# Altium schematic sheet PCB_LED_CALENDAR__SINGLE_YEAR_DIGIT.SchDoc
size A4; Author: Andrzej Laczewski; DrawnBy: Andrzej Laczewski; SheetNumber: 3; SheetTotal: 4
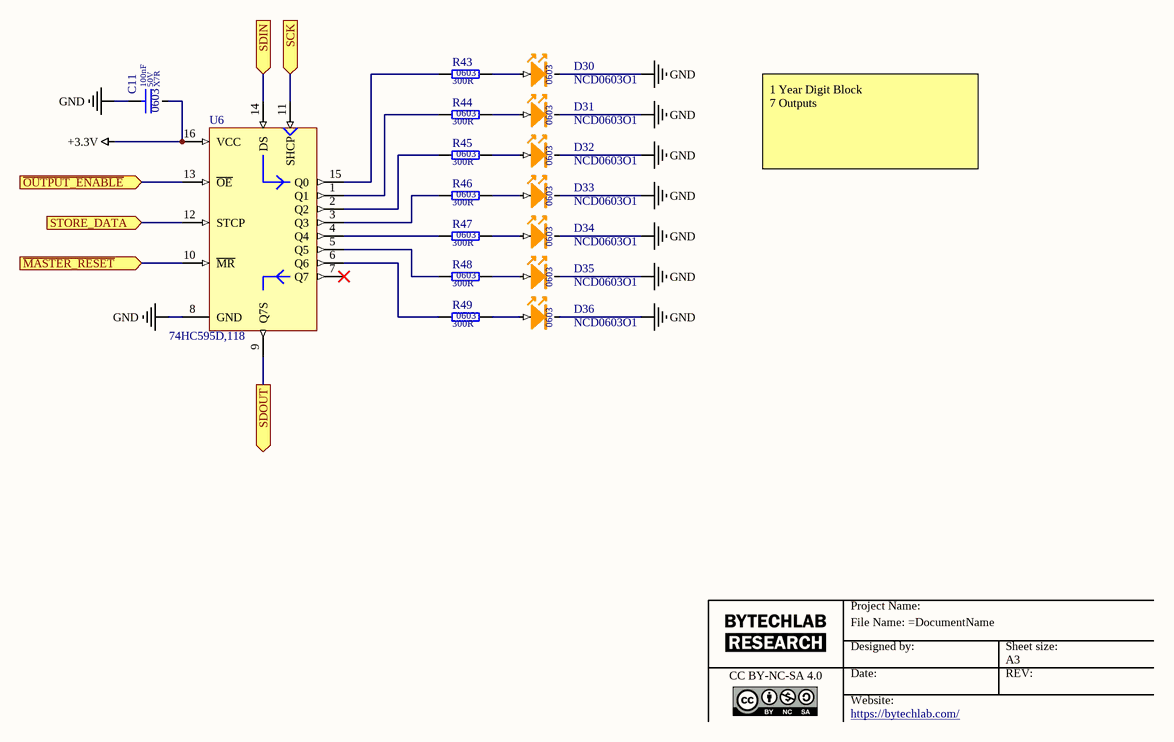
[diagram p0: PCB_LED_CALENDAR__SINGLE_YEAR_DIGIT.SchDoc]

## Parts
C11  value 100nF  Dielectric: X7R  Voltage: 50V  SCH_Footprint: 0603  [C_0603_1608]  (hidden comment: Ceramic X7R)
D30  NCD0603O1  SCH_Footprint: 0603  [LED_0603]
D31  NCD0603O1  SCH_Footprint: 0603  [LED_0603]
D32  NCD0603O1  SCH_Footprint: 0603  [LED_0603]
D33  NCD0603O1  SCH_Footprint: 0603  [LED_0603]
D34  NCD0603O1  SCH_Footprint: 0603  [LED_0603]
D35  NCD0603O1  SCH_Footprint: 0603  [LED_0603]
D36  NCD0603O1  SCH_Footprint: 0603  [LED_0603]
R43  value 300R  SCH_Footprint: 0603  [R_0603_1608]  (hidden comment: Resistor)
R44  value 300R  SCH_Footprint: 0603  [R_0603_1608]  (hidden comment: Resistor)
R45  value 300R  SCH_Footprint: 0603  [R_0603_1608]  (hidden comment: Resistor)
R46  value 300R  SCH_Footprint: 0603  [R_0603_1608]  (hidden comment: Resistor)
R47  value 300R  SCH_Footprint: 0603  [R_0603_1608]  (hidden comment: Resistor)
R48  value 300R  SCH_Footprint: 0603  [R_0603_1608]  (hidden comment: Resistor)
R49  value 300R  SCH_Footprint: 0603  [R_0603_1608]  (hidden comment: Resistor)
U6  74HC595D,118  [SO16]

## Ports
SCK (in), SDIN (in), SDOUT (out), STORE_DATA (in), ~{MASTER_RESET} (in), ~{OUTPUT_ENABLE} (in)

## Nets
+3.3V: C11.2 U6.16(VCC)
GND: C11.1 D30.1(K) D31.1(K) D32.1(K) D33.1(K) D34.1(K) D35.1(K) D36.1(K) U6.8(GND)
~{MASTER_RESET}: U6.10(~{MR}) ; port ~{MASTER_RESET}
~{OUTPUT_ENABLE}: U6.13(~{OE}) ; port ~{OUTPUT_ENABLE}
SCK: U6.11(SHCP) ; port SCK
SDIN: U6.14(DS) ; port SDIN
SDOUT: U6.9(Q7S) ; port SDOUT
STORE_DATA: U6.12(STCP) ; port STORE_DATA
NetD30_2: D30.2(A) R43.2
NetD31_2: D31.2(A) R44.2
NetD32_2: D32.2(A) R45.2
NetD33_2: D33.2(A) R46.2
NetD34_2: D34.2(A) R47.2
NetD35_2: D35.2(A) R48.2
NetD36_2: D36.2(A) R49.2
NetR43_1: R43.1 U6.15(Q0)
NetR44_1: R44.1 U6.1(Q1)
NetR45_1: R45.1 U6.2(Q2)
NetR46_1: R46.1 U6.3(Q3)
NetR47_1: R47.1 U6.4(Q4)
NetR48_1: R48.1 U6.5(Q5)
NetR49_1: R49.1 U6.6(Q6)

Not connected (* = marked no-connect by the designer): U6 7(Q7)*

## Notes on the sheet
- 1 Year Digit Block
  7 Outputs
- Project Name:
- File Name: =DocumentName
- CC BY-NC-SA 4.0
- Designed by:
- Date:
- Website:
- Sheet size:
- A3
- REV:
- https://bytechlab.com/
- Title:
- from project
- Sheet:
- of
- Revision
- Author:
- File name:
- Checked by:
- Size:
- A2
- Approved by:

## Library data of the parts
C11 = C_100nF_50V_X7R_0603_5: Capacitor; Manufacturer: Samsung; Manufacturer Part Number: CL10B104JB8NNNC; Tolerance (%): 5; Part Number: C_100nF_50V_X7R_0603_5; HelpURL: http://www.tme.eu/pl/Document/4a42202b32dab16128fe107dd69598cc/samsung-chip-cap.pdf; Supplier 1: TME; Supplier Part Number 1: CL10B104JB8NNNC; Supplier 2: RS Components; Supplier Part Number 2: 7665455; Supplier 3: Farnell; Supplier 4: Mouser; Supplier 5: Digi-Key; Supplier Part Number 5: 1276-1033-1-ND; Supplier 6: LCSC; Supplier Part Number 6: C24452
D30-D36 = OL_NCD0603O1: Orange 130° 65mW 1.6V~2.6V 0603; Manufacturer: Foshan NationStar Optoelectronics; Manufacturer Part Number: NCD0603O1; Supplier 1: JLCPCB; Supplier Part Number 1: C84269
R43-R49 = R_300R_0603_1: Manufacturer: Yageo; Manufacturer Part Number: RC0603FR-07300RL; Voltage: 50V; Power: 100mW; Tolerance: 1%; Part Number: R_300R_0603_1; HelpURL: https://www.tme.eu/Document/d2a72e545e5c8eb7bf2a04fa97535928/rc0603yageo.pdf; Supplier 1: TME; Supplier Part Number 1: RC0603FR-07300R; Supplier 2: RS Components; Supplier 3: Farnell; Supplier Part Number 3: 2413696; Supplier 4: Mouser; Supplier Part Number 4: 603-RC0603FR-07300RL; Supplier 5: Digi-Key; Supplier Part Number 5: 311-300HRCT-ND; Supplier 6: LCSC
U6 = U_74HC595D,118: 8-bit serial-in, serial or parallel-out shift register with output latches; 3-state; Manufacturer: Nexperia; Manufacturer Part Number: 74HC595D,118; Supplier 1: JLCPCB; Supplier Part Number 1: C5947